# EAGLE design PMT AMP_J000331REVH (EAGLE 7.7.0)

## Sheet 1 of 2
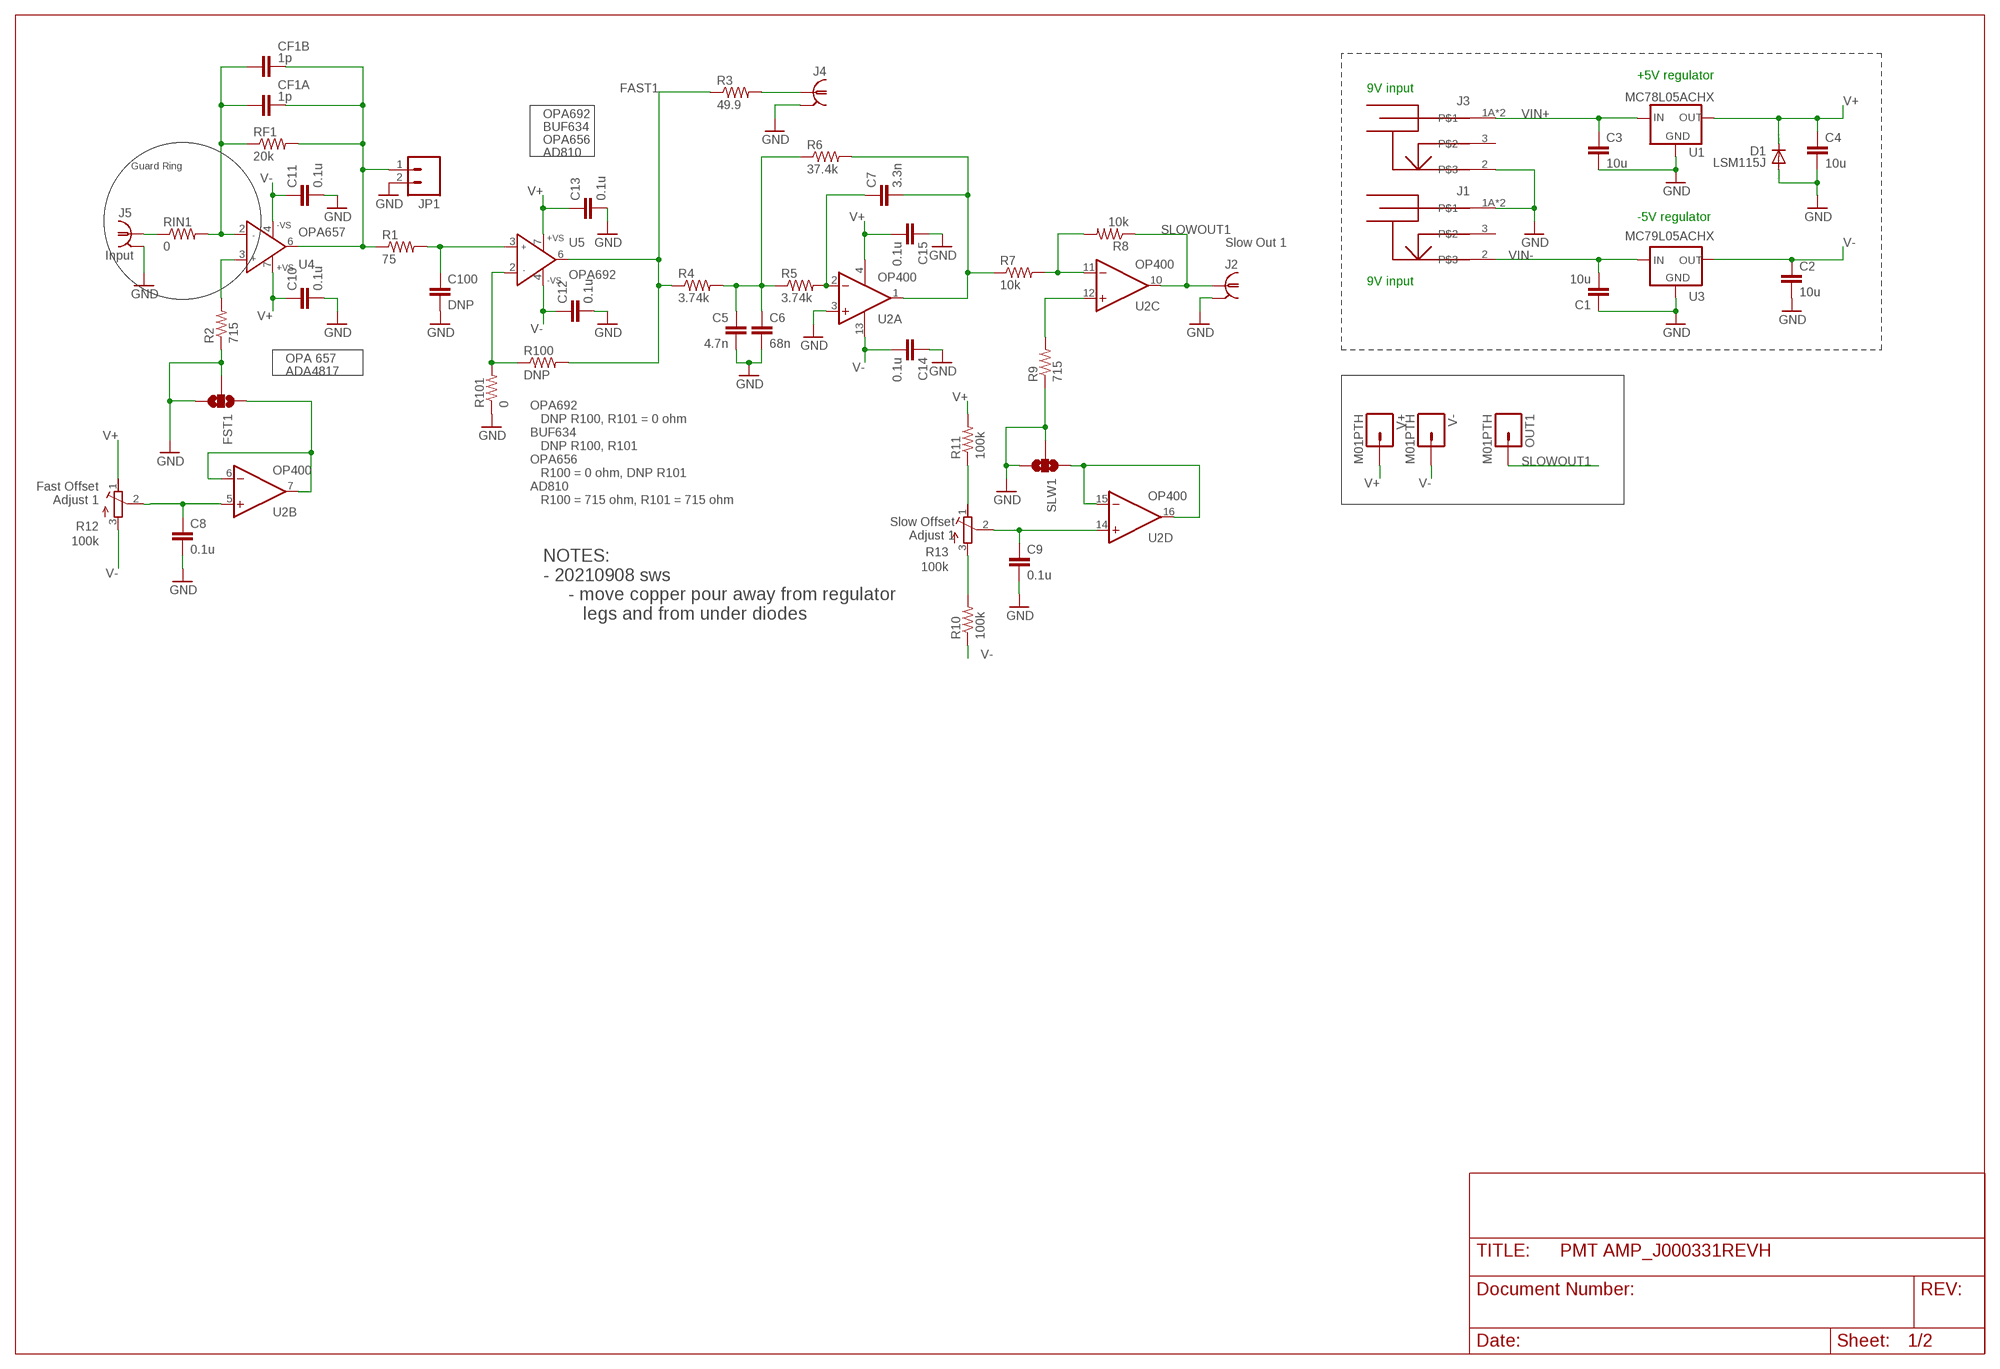
[diagram p0: schematic, sheet 1]

### Parts
C1  10u  C-EUC1206  [C1206]
C2  10u  C-EUC1206  [C1206]
C3  10u  C-EUC1206  [C1206]
C4  10u  C-EUC1206  [C1206]
C5  4.7n  C-EUC0805  [C0805]
C6  68n  C-EUC0805  [C0805]
C7  3.3n  C-EUC0805  [C0805]
C8  0.1u  C-EUC0603  [C0603]
C9  0.1u  C-EUC0603  [C0603]
C10  0.1u  C-EUC0603  [C0603]
C11  0.1u  C-EUC0603  [C0603]
C12  0.1u  C-EUC0603  [C0603]
C13  0.1u  C-EUC0603  [C0603]
C14  0.1u  C-EUC0603  [C0603]
C15  0.1u  C-EUC0603  [C0603]
C100  DNP  C-EUC0805  [C0805]
CF1A  1p  C-EUC1206  [C1206]
CF1B  1p  C-EUC1206  [C1206]
D1  LSM115J  DIODE-DO214BA  [DO214BA]
FST1  SOLDERJUMPER_2WAYS  [SJ_3]
J1  POWER_JACK_SHUNTPJ-002  [PJ-002]
J2  1-227161-0  [AMP_227161]
J3  POWER_JACK_SHUNTPJ-002  [PJ-002]
J4  1-227161-0  [AMP_227161]
J5  1-227161-0  [AMP_227161]
JP1  M02LOCK  [1X02_LOCK]
OUT1  M01PTH  [1X01]
R1  75  R-US_R0805  [R0805]
R2  715  R-US_R0805  [R0805]
R3  49.9  RESISTOR-POWER2512WIDE  [2512LONG]
R4  3.74k  R-US_R0805  [R0805]
R5  3.74k  R-US_R0805  [R0805]
R6  37.4k  R-US_R0805  [R0805]
R7  10k  R-US_R0805  [R0805]
R8  10k  R-US_R0805  [R0805]
R9  715  R-US_R0805  [R0805]
R10  100k  R-US_R0805  [R0805]
R11  100k  R-US_R0805  [R0805]
R12  100k  R-TRIMM3006P  [RTRIM3006P]
R13  100k  R-TRIMM3006P  [RTRIM3006P]
R100  DNP  R-US_R0805  [R0805]
R101  0  R-US_R0805  [R0805]
RF1  20k  R-US_R1206  [R1206]
RIN1  0  R-US_R0805  [R0805]
SLW1  SOLDERJUMPER_2WAYS  [SJ_3]
U1  MC78L05ACHX  78LXXSOT89  [SOT89]
U2  OP400  OP400SO16_W  [SO16L]
U3  MC79L05ACHX  79LXXSOT89  [SOT89]
U4  OPA657  AD820R  [SO8]
U5  OPA692  AD820R  [SO8]
V+  M01PTH  [1X01]
V-  M01PTH  [1X01]

### Nets
FAST1: R3.1 R4.1 R100.2 U5.6(OUT)
FO1: J4.1 R3.2
GND: C1.1 C2.2 C3.2 C4.2 C5.2 C6.2 C8.2 C9.2 C10.2 C11.2 C12.2 C13.2 C14.1 C15.1 C100.2 D1.A FST1.2 FST1.3 J1.1A J1.1B J2.2(GND) J3.2 J4.2(GND) J5.2(GND) JP1.2 R2.1 R9.1 R101.1 SLW1.2 SLW1.3 U1.2(GND) U1.2@1(GND) U2.3(A:+IN) U3.1(GND) ; also sheet 2
N$1: CF1A.1 CF1B.1 RF1.1 RIN1.2 U4.2(IN-)
N$2: R7.2 R8.2 U2.11(C:-IN)
N$3: C100.1 R1.2 U5.3(IN+)
N$4: C8.1 R12.2(S) U2.5(B:+IN)
N$5: C9.1 R13.2(S) U2.14(D:+IN)
N$6: R11.1 R13.1(E)
N$7: R10.2 R13.3(A)
N$8: J5.1 RIN1.1
N$10: R100.1 R101.2 U5.2(IN-)
N$11: C7.1 R5.2 U2.2(A:-IN)
N$12: SLW1.1 U2.15(D:-IN) U2.16(D:OUT)
N$17: FST1.1 U2.6(B:-IN) U2.7(B:OUT)
N$19: C7.2 R6.2 R7.1 U2.1(A:OUT)
N$28: C5.1 C6.1 R4.2 R5.1 R6.1
N$29: R9.2 U2.12(C:+IN)
N$30: R2.2 U4.3(IN+)
SLOWOUT1: J2.1 OUT1.1 R8.1 U2.10(C:OUT)
U4OUT1: CF1A.2 CF1B.2 JP1.1 R1.1 RF1.2 U4.6(OUT)
V+: C4.1 C10.1 C13.1 C15.2 D1.C R11.2 R12.1(E) U1.1(OUT) U2.4(P:V+) U4.7(+VS) U5.7(+VS) V+.1
V-: C2.1 C11.1 C12.1 C14.2 R10.1 R12.3(A) U2.13(P:V-) U3.3(OUT) U4.4(-VS) U5.4(-VS) V-.1
VIN+: C3.1 J3.1A J3.1B U1.3(IN) ; also sheet 2
VIN-: C1.2 J1.2 U3.2(IN) U3.2@1(IN) ; also sheet 2
Unconnected: J1.3 J3.3

### Notes on the sheet
- +5V regulator
- 9V input
- OPA692
- BUF634
- OPA656
- AD810
- Guard Ring
- -5V regulator
- Slow Out 1
- Input
- 9V input
- OPA 657
- ADA4817
- Fast Offset
  Adjust 1
- OPA692
     DNP R100, R101 = 0 ohm
  BUF634
     DNP R100, R101
  OPA656
     R100 = 0 ohm, DNP R101
  AD810
     R100 = 715 ohm, R101 = 715 ohm
- Slow Offset
  Adjust 1
- NOTES:
  - 20210908 sws
       - move copper pour away from regulator
          legs and from under diodes

## Sheet 2 of 2
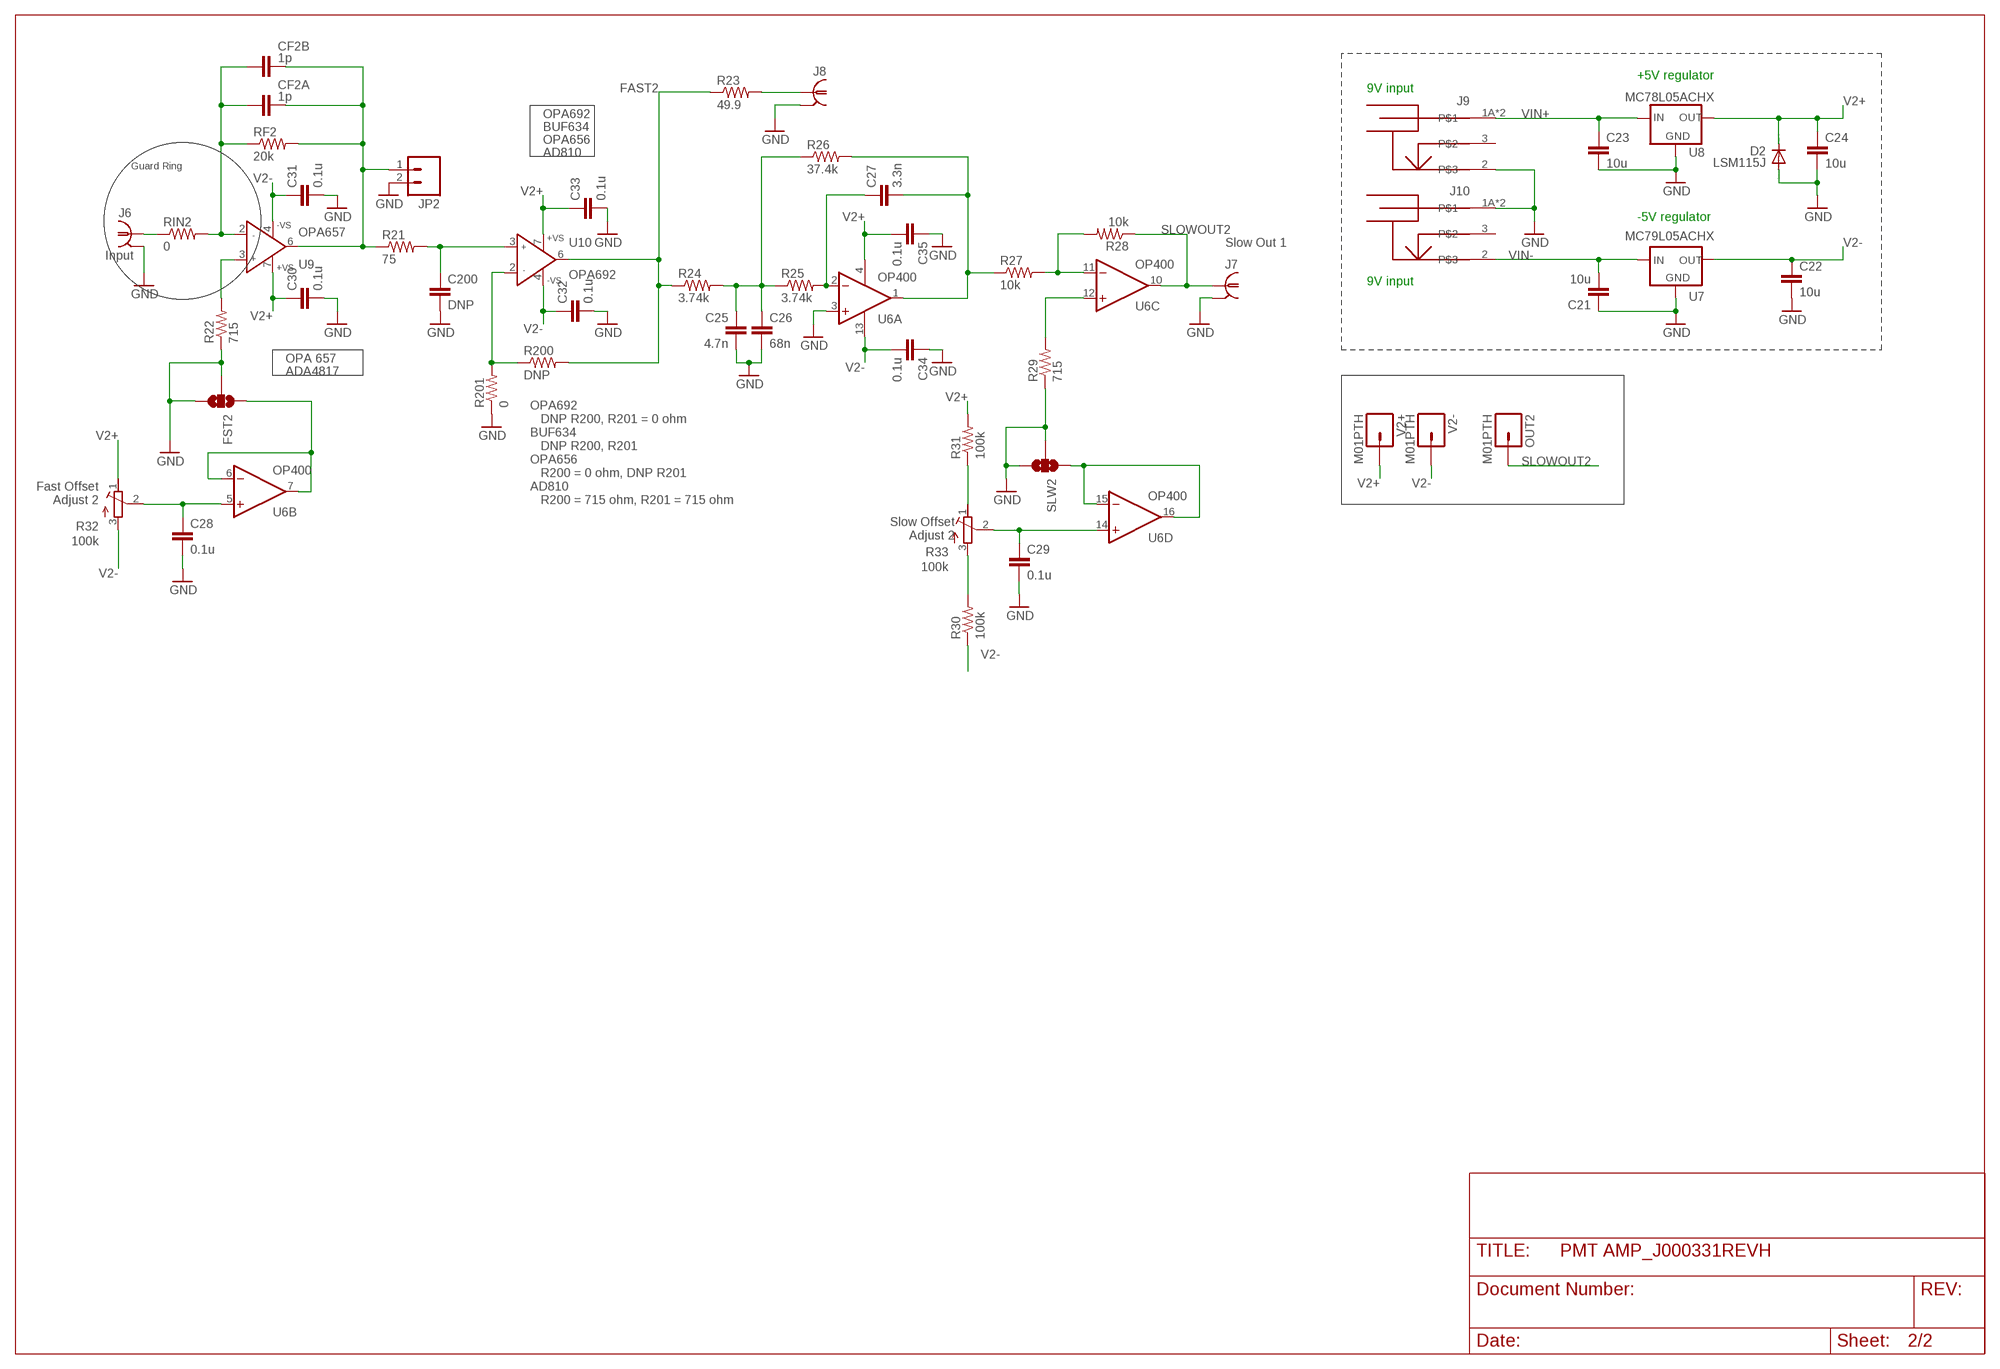
[diagram p1: schematic, sheet 2]

### Parts
C21  10u  C-EUC1206  [C1206]
C22  10u  C-EUC1206  [C1206]
C23  10u  C-EUC1206  [C1206]
C24  10u  C-EUC1206  [C1206]
C25  4.7n  C-EUC0805  [C0805]
C26  68n  C-EUC0805  [C0805]
C27  3.3n  C-EUC0805  [C0805]
C28  0.1u  C-EUC0603  [C0603]
C29  0.1u  C-EUC0603  [C0603]
C30  0.1u  C-EUC0603  [C0603]
C31  0.1u  C-EUC0603  [C0603]
C32  0.1u  C-EUC0603  [C0603]
C33  0.1u  C-EUC0603  [C0603]
C34  0.1u  C-EUC0603  [C0603]
C35  0.1u  C-EUC0603  [C0603]
C200  DNP  C-EUC0805  [C0805]
CF2A  1p  C-EUC1206  [C1206]
CF2B  1p  C-EUC1206  [C1206]
D2  LSM115J  DIODE-DO214BA  [DO214BA]
FST2  SOLDERJUMPER_2WAYS  [SJ_3]
J6  1-227161-0  [AMP_227161]
J7  1-227161-0  [AMP_227161]
J8  1-227161-0  [AMP_227161]
J9  POWER_JACK_SHUNTPJ-002  [PJ-002]
J10  POWER_JACK_SHUNTPJ-002  [PJ-002]
JP2  M02LOCK  [1X02_LOCK]
OUT2  M01PTH  [1X01]
R21  75  R-US_R0805  [R0805]
R22  715  R-US_R0805  [R0805]
R23  49.9  RESISTOR-POWER2512WIDE  [2512LONG]
R24  3.74k  R-US_R0805  [R0805]
R25  3.74k  R-US_R0805  [R0805]
R26  37.4k  R-US_R0805  [R0805]
R27  10k  R-US_R0805  [R0805]
R28  10k  R-US_R0805  [R0805]
R29  715  R-US_R0805  [R0805]
R30  100k  R-US_R0805  [R0805]
R31  100k  R-US_R0805  [R0805]
R32  100k  R-TRIMM3006P  [RTRIM3006P]
R33  100k  R-TRIMM3006P  [RTRIM3006P]
R200  DNP  R-US_R0805  [R0805]
R201  0  R-US_R0805  [R0805]
RF2  20k  R-US_R1206  [R1206]
RIN2  0  R-US_R0805  [R0805]
SLW2  SOLDERJUMPER_2WAYS  [SJ_3]
U6  OP400  OP400SO16_W  [SO16L]
U7  MC79L05ACHX  79LXXSOT89  [SOT89]
U8  MC78L05ACHX  78LXXSOT89  [SOT89]
U9  OPA657  AD820R  [SO8]
U10  OPA692  AD820R  [SO8]
V2+  M01PTH  [1X01]
V2-  M01PTH  [1X01]

### Nets
FAST2: R23.1 R24.1 R200.2 U10.6(OUT)
FO2: J8.1 R23.2
GND: C21.1 C22.2 C23.2 C24.2 C25.2 C26.2 C28.2 C29.2 C30.2 C31.2 C32.2 C33.2 C34.1 C35.1 C200.2 D2.A FST2.2 FST2.3 J6.2(GND) J7.2(GND) J8.2(GND) J9.2 J10.1A J10.1B JP2.2 R22.1 R29.1 R201.1 SLW2.2 SLW2.3 U6.3(A:+IN) U7.1(GND) U8.2(GND) U8.2@1(GND) ; also sheet 1
N$9: CF2A.1 CF2B.1 RF2.1 RIN2.2 U9.2(IN-)
N$13: J6.1 RIN2.1
N$14: C200.1 R21.2 U10.3(IN+)
N$15: R200.1 R201.2 U10.2(IN-)
N$16: C28.1 R32.2(S) U6.5(B:+IN)
N$18: C27.1 R25.2 U6.2(A:-IN)
N$20: C29.1 R33.2(S) U6.14(D:+IN)
N$21: C27.2 R26.2 R27.1 U6.1(A:OUT)
N$22: SLW2.1 U6.15(D:-IN) U6.16(D:OUT)
N$23: R27.2 R28.2 U6.11(C:-IN)
N$24: R31.1 R33.1(E)
N$25: R30.2 R33.3(A)
N$26: C25.1 C26.1 R24.2 R25.1 R26.1
N$27: FST2.1 U6.6(B:-IN) U6.7(B:OUT)
N$33: R29.2 U6.12(C:+IN)
N$34: R22.2 U9.3(IN+)
SLOWOUT2: J7.1 OUT2.1 R28.1 U6.10(C:OUT)
U9OUT1: CF2A.2 CF2B.2 JP2.1 R21.1 RF2.2 U9.6(OUT)
V2+: C24.1 C30.1 C33.1 C35.2 D2.C R31.2 R32.1(E) U6.4(P:V+) U8.1(OUT) U9.7(+VS) U10.7(+VS) V2+.1
V2-: C22.1 C31.1 C32.1 C34.2 R30.1 R32.3(A) U6.13(P:V-) U7.3(OUT) U9.4(-VS) U10.4(-VS) V2-.1
VIN+: C23.1 J9.1A J9.1B U8.3(IN) ; also sheet 1
VIN-: C21.2 J10.2 U7.2(IN) U7.2@1(IN) ; also sheet 1
Unconnected: J9.3 J10.3

### Notes on the sheet
- +5V regulator
- 9V input
- OPA692
- BUF634
- OPA656
- AD810
- Guard Ring
- -5V regulator
- Slow Out 1
- Input
- 9V input
- OPA 657
- ADA4817
- Fast Offset
  Adjust 2
- OPA692
     DNP R200, R201 = 0 ohm
  BUF634
     DNP R200, R201
  OPA656
     R200 = 0 ohm, DNP R201
  AD810
     R200 = 715 ohm, R201 = 715 ohm
- Slow Offset
  Adjust 2

## Library data of the parts
C1-C15 C21-C35 C100 C200 CF1A CF1B CF2A CF2B = rcl:C-EU: CAPACITOR, European symbol
D1 D2 = diode:DIODE-: DIODE
FST1 FST2 SLW1 SLW2 = SparkFun:SOLDERJUMPER_2WAY: Solder Jumper 2 way solder jumper
J1 J3 J9 J10 = STEVES_BU:POWER_JACK_SHUNT
J2 J4-J8 = con-coax:?227161*: JACK, RIGHT ANGLE, 50 OHM, PCB, BNC Source: amp_227161.pdf; MF: TE; MPN: 5413879-1; OC_FARNELL: unknown; OC_NEWARK: 33B3200
JP1 JP2 = SparkFun:M02: Header 2 Standard 2-pin 0.1" header. Use with straight break away headers (SKU : PRT-00116), right angle break away headers (PRT-00553), swiss pins (PRT-00743), machine pins (PRT-00117), and female headers (PRT-00115). Molex polarized connector foot print use with SKU : PRT-08233 with associated crimp pins and housings.
OUT1 OUT2 V2+ V2- V+ V- = SparkFun:M01: Header 1 Standard 1-pin 0.1" header. Use with straight break away headers (SKU : PRT-00116), right angle break away headers (PRT-00553), swiss pins (PRT-00743), machine pins (PRT-00117), and female headers (PRT-00115).
R1 R2 R4-R11 R21 R22 R24-R31 R100 R101 R200 R201 RIN1 RIN2 = rcl:R-US_: RESISTOR, American symbol
R3 R23 = STEVES_BU:RESISTOR-POWER
R12 R13 R32 R33 = rcl:R-TRIMM: Trimm resistor; MF: BOURNS; MPN: 3006P-1-104LF
RF1 RF2 = resistor:R-US_: RESISTOR, American symbol
U1 U8 = jfrc:78LXX: VOLTAGE REGULATOR
U2 U6 = linear:OP400: OP AMP
U3 U7 = jfrc:79LXX: VOLTAGE REGULATOR
U4 U5 U9 U10 = analog-devices:AD820: Single-Supply, Rail-to-Rail, Low Power, FET Input Op Amp Source: http://www.analog.com/static/imported-files/data_sheets/AD820.pdf; OC_FARNELL: 1838867; OC_NEWARK: unknown

## Board
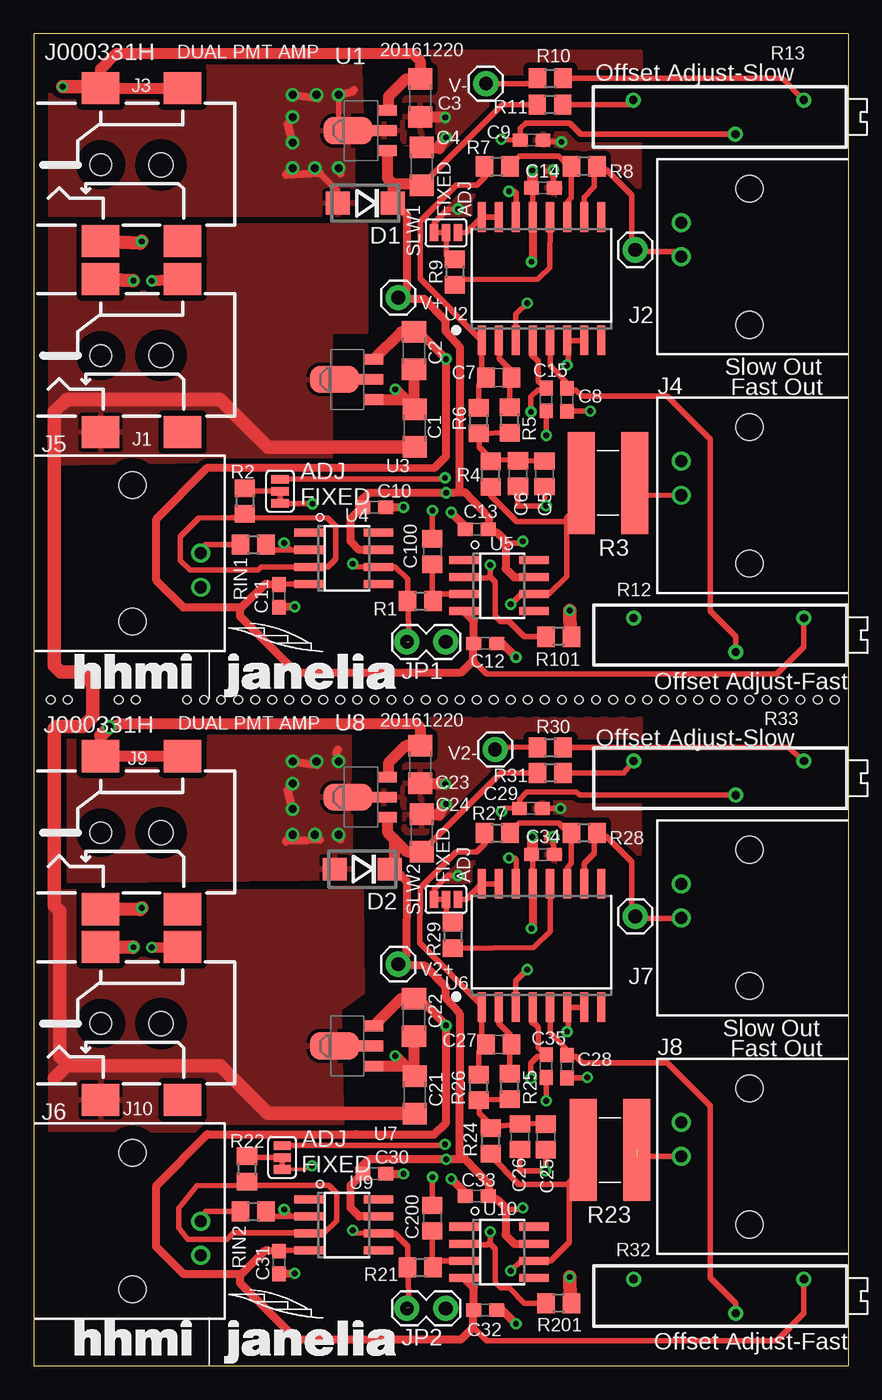
[diagram p2: board, top side]
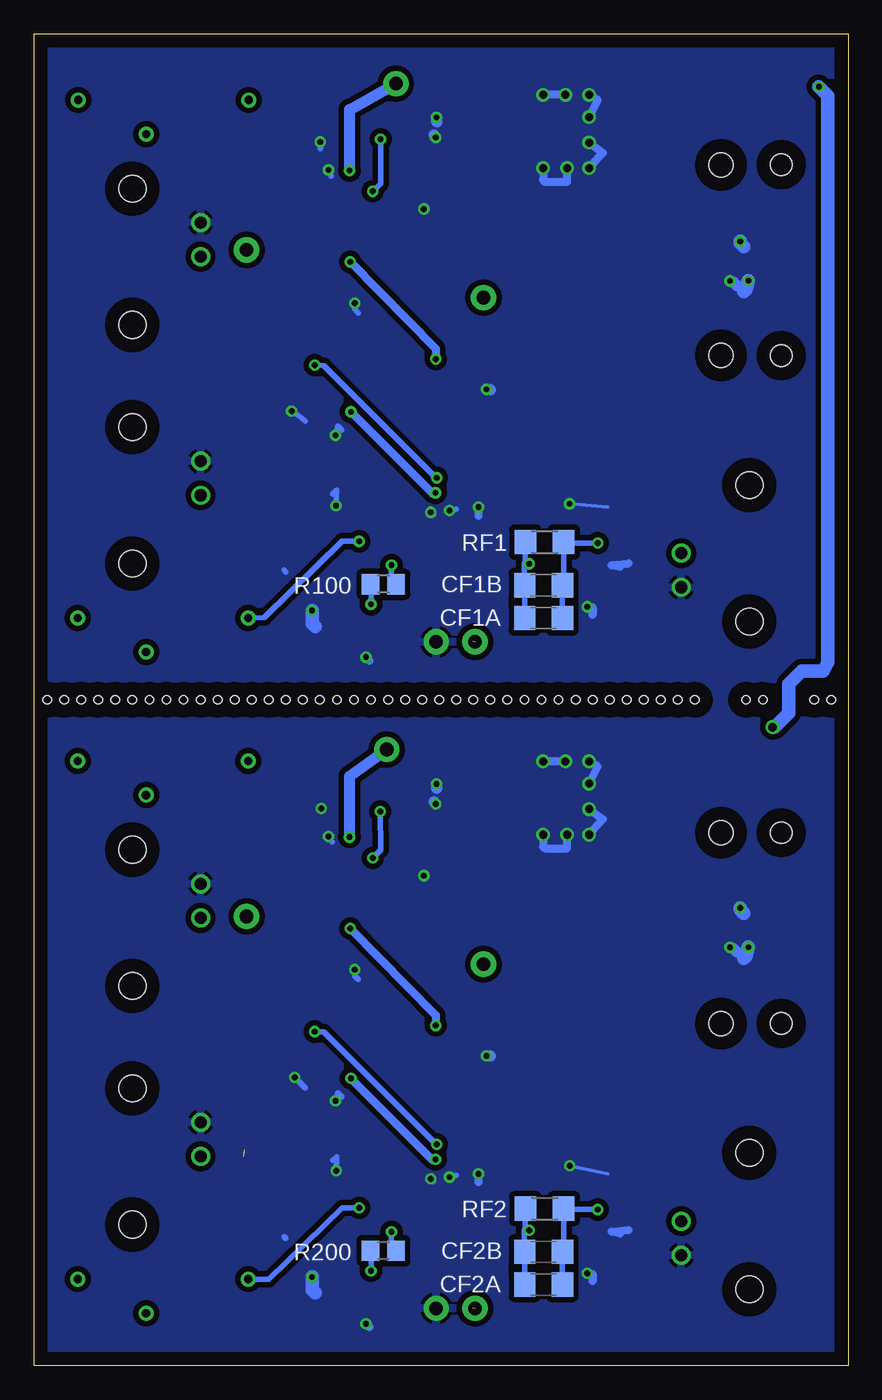
[diagram p3: board, bottom side, seen from below]

Size 60.71 x 99.31 mm. Coordinates in mm from the lower left corner, seen from the top.
Outline: 60.71,99.31 0,99.31 0,0 60.71,0 60.71,99.31
Copper layers (1*16): Top 0.035mm / dielectric 1.5mm / Bottom 0.035mm
Design rules "default *": minimum track width 10mil, minimum drill 17mil, track to track 8mil, track to pad 8mil, pad to pad 8mil, via to via 8mil, smd to smd 8mil, copper to edge 40mil, drill to drill 8mil, minimum pad ring 10mil, minimum via ring 8mil, stop-mask expansion 4mil, vias tented up to drill 25mil, thermal gap 10mil
Holes 0.64 mm at 1.27,49.66 2.54,49.66 6.35,49.66 7.62,49.66 11.43,49.66 12.7,49.66 13.97,49.66 15.24,49.66 16.51,49.66 17.78,49.66 19.05,49.66 20.32,49.66 21.59,49.66 22.86,49.66 24.13,49.66 25.4,49.66 26.67,49.66 27.94,49.66 29.21,49.66 30.48,49.66 31.75,49.66 33.02,49.66 34.29,49.66 35.56,49.66 36.83,49.66 38.1,49.66 39.37,49.66 40.64,49.66 41.91,49.66 43.18,49.66 44.45,49.66 45.72,49.66 46.99,49.66 48.26,49.66 49.53,49.66 50.8,49.66 52.07,49.66 53.34,49.66 54.61,49.66 55.88,49.66 57.15,49.66 58.42,49.66 59.69,49.66

### Footprints (pad centres in the part's own frame; a part is rotated, then mirrored left to right if it is on the bottom)
C1206 = smd 1.6 x 1.8: 1 -1.4,0; 2 1.4,0
C0805 = smd 1.3 x 1.5: 1 -0.95,0; 2 0.95,0
C0603 = smd 1.1 x 1: 1 -0.85,0; 2 0.85,0
DO214BA = smd 1.8 x 1.7: A 2.05,0; C -2.05,0
SJ_3 = smd 0.635 x 1.27: 1 -0.889,0; 2 0,0; 3 0.889,0
PJ-002 = smd 2.8 x 2.4: 1A 5,5.7; 1B 11.1,5.7; 2 5,-5.7; 3 11.1,-5.7 | hole 1.6: 5,0 | hole 1.8: 9.5,0
AMP_227161 = drill 0.9 pad 1.27: 1 0,-5.08; 2 -2.54,-5.08 | hole 2: -5.08,0; 5.08,0
1X02_LOCK = drill 1.016 pad 1.88: 1 -0.178,0; 2 2.718,0
1X01 = drill 1.016 pad 1.88: 1 0,0
R0805 = smd 1.3 x 1.5: 1 -0.95,0; 2 0.95,0
2512LONG = smd 7.6 x 2: 1 0,2; 2 0,-2
RTRIM3006P = drill 0.61: 1 -7.62,1.27; 2 0,-1.27; 3 5.08,1.27
R1206 = smd 1.6 x 1.803: 1 -1.422,0; 2 1.422,0
SOT89 = smd 0.8 x 1.4: 1 -1.499,-1.981; 3 1.499,-1.981 | smd 0.8 x 1.9: 2 0,-1.727 | smd 2.032 x 3.65: 2@1 0,0.94
SO16L = smd 0.6 x 2.2: 1 -4.445,-4.6; 2 -3.175,-4.6; 3 -1.905,-4.6; 4 -0.635,-4.6; 5 0.635,-4.6; 6 1.905,-4.6; 7 3.175,-4.6; 8 4.445,-4.6; 9 4.445,4.6; 10 3.175,4.6; 11 1.905,4.6; 12 0.635,4.6; 13 -0.635,4.6; 14 -1.905,4.6; 15 -3.175,4.6; 16 -4.445,4.6
SO8 = smd 0.6 x 2.2: 1 -1.905,-2.6; 2 -0.635,-2.6; 3 0.635,-2.6; 4 1.905,-2.6; 5 1.905,2.6; 6 0.635,2.6; 7 -0.635,2.6; 8 -1.905,2.6

### Placement (x,y rotation side)
C1  28.4,69.9 270 top
C2  28.35,75.67 270 top
C3  28.8,94.51 270 top
C4  28.93,89.41 90 top
C5  38.07,66.5 270 top
C6  36.09,66.52 270 top
C7  34.67,73.66 180 top
C8  39.75,72.01 270 top
C9  37.11,91.36 0 top
C10  25.4,64.01 0 top
C11  18.29,57.4 270 top
C12  33.66,53.85 0 top
C13  33.02,62.36 180 top
C14  37.95,87.81 180 top
C15  38.2,72.03 90 top
C21  28.4,20.22 270 top
C22  28.35,25.98 270 top
C23  28.8,44.83 270 top
C24  28.93,39.73 90 top
C25  38.18,17.07 270 top
C26  36.25,17.09 270 top
C27  34.67,23.98 180 top
C28  39.75,22.33 270 top
C29  37.06,41.55 0 top
C30  25.4,14.33 0 top
C31  18.29,7.72 270 top
C32  33.66,4.17 0 top
C33  33.02,12.67 180 top
C34  37.95,38.13 180 top
C35  38.2,22.35 90 top
C100  29.72,60.71 90 top
C200  29.72,11.02 90 top
CF1A  22.71,55.75 180 bottom
CF1B  22.71,58.19 180 bottom
CF2A  22.71,6.07 180 bottom
CF2B  22.71,8.51 180 bottom
D1  24.71,86.66 180 top
D2  24.49,37.03 180 top
FST1  18.36,65.2 270 top
FST2  18.52,15.54 270 top
J1  0,75.31 0 top
J2  53.34,82.68 270 top
J3  0,89.53 0 top
J4  53.34,64.9 270 top
J5  7.37,60.58 90 top
J6  7.37,10.79 90 top
J7  53.34,33.4 270 top
J8  53.34,15.62 270 top
J9  0,39.75 0 top
J10  0,25.53 0 top
JP1  27.99,53.97 0 top
JP2  27.99,4.29 0 top
OUT1  44.83,83.19 0 top
OUT2  44.83,33.5 0 top
R1  28.83,57.02 0 top
R2  15.75,64.47 270 top
R3  42.8,65.81 90 top
R4  34.06,66.47 90 top
R5  35.48,70.51 90 top
R6  33.17,70.46 90 top
R7  34.54,89.41 0 top
R8  41.02,89.41 180 top
R9  31.39,81.53 270 top
R10  38.51,95.99 0 top
R11  38.48,94.01 180 top
R12  52.32,54.48 0 top
R13  52.3,93.09 0 top
R21  28.83,7.34 0 top
R22  15.9,14.68 270 top
R23  42.95,16.1 90 top
R24  34.06,16.79 90 top
R25  35.48,20.83 90 top
R26  33.17,20.78 90 top
R27  34.54,39.73 0 top
R28  41.02,39.73 180 top
R29  31.24,32.08 270 top
R30  38.51,46.1 0 top
R31  38.51,44.2 180 top
R32  52.32,5.21 0 top
R33  52.32,43.81 0 top
R100  34.65,58.27 180 bottom
R101  39.12,54.36 180 top
R200  34.65,8.59 180 bottom
R201  39.12,4.67 180 top
RF1  22.63,61.42 180 bottom
RF2  22.63,11.73 180 bottom
RIN1  16.38,61.21 0 top
RIN2  16.38,11.53 0 top
SLW1  30.73,84.45 180 top
SLW2  30.73,34.77 180 top
U1  24.38,92.07 90 top
U2  37.85,81.03 0 top
U3  23.37,73.53 90 top
U4  23.11,60.2 270 top
U5  34.67,58.17 270 top
U6  37.85,31.34 0 top
U7  23.37,23.85 90 top
U8  24.38,42.39 90 top
U9  23.11,10.52 270 top
U10  34.67,8.48 270 top
U$1  JFRC-LOGOLOGO_JANELIA_2014  [LOGO_JANELIA_2014]  2.46,49.81 0 top
U$2  JFRC-LOGOLOGO_JANELIA_2014  [LOGO_JANELIA_2014]  2.46,0.13 0 top
V2+  27.18,29.95 0 top
V2-  34.39,45.95 0 top
V+  27.18,79.63 0 top
V-  33.71,95.58 0 top

### Tracks (layer width: path | path; a pad name or v marks a point on that pad's centre or on a via)
FAST1  (via drill 0.43)
  Top 0.406: v35.56,56.77 36.32,57.53 U5.6 | 37.38,57.53 U5.6 | R3.1 40.8,64.27 39.73,63.19 39.73,63.02 | 39.73,63.02 39.73,58.85 38.41,57.53 U5.6 | R4.1 34.06,64.87 35.99,62.94 39.65,62.94 39.73,63.02
  Bottom 0.406: R100.2 35.5,56.83 v35.56,56.77
FAST2  (via drill 0.43)
  Top 0.406: v35.56,7.09 36.32,7.85 U10.6 | 37.38,7.85 U10.6 | R23.1 40.95,14.79 39.9,13.74 39.9,13.41 | 39.9,13.41 39.9,9.22 38.53,7.85 U10.6 | R24.1 34.06,15.65 36.17,13.54 39.78,13.54 39.9,13.41
  Bottom 0.406: R200.2 35.5,7.15 v35.56,7.09
FO1
  Top 0.406: R3.2 45.19,64.87 J4.1
FO2  (1 unrouted)
  Top 0.406: J8.1 45.03,15.62 45.03,16.81
GND  (via drill 0.43, 0.6)
  Top 0.254: FST2.3 20.24,14.66 v20.75,14.91
  Top 0.406: C9.2 38.28,91.24 v39.34,91.24 | C100.2 v29.72,63.75 | U2.3 35.94,78.38 v36.78,79.22 | C15.1 v38.2,69.37 | C8.2 v41.48,71.17 | C14.1 38.71,88.47 38.66,89.1 38.25,89.05 v38.73,89.15 | C29.2 v39.27,41.55 | C200.2 v29.72,14.07 | v31.62,36.55 30.86,36.55 29.84,35.53 SLW2.3 SLW2.2 30.73,33.48 R29.1 | U6.3 35.94,28.7 v36.78,29.54 | C26.2 36.24,14.55 v38.15,14.55 38.15,15.76 C25.2 | C35.1 v38.2,19.76 | C34.1 38.71,38.79 38.66,39.42 38.25,39.37 v38.73,39.47 | C6.2 36.09,64.11 38.18,64.11 v38.18,64.13 38.08,64.24 C5.2 | v31.62,86.23 30.86,86.23 29.84,85.22 SLW1.3 SLW1.2 30.73,82.8 R9.1 | R2.1 15.82,65.2 FST1.2 FST1.3 18.41,64.26 v20.78,64.26 | R22.1 16.51,15.54 FST2.2 FST2.3 | C28.2 41.21,21.48 v41.25,21.51 | D1.A 22.66,87.57 v20.95,89.28 | v22.73,94.74 22.73,92.79 U1.2@1 U1.2
  Top 0.61: C10.2 v27.56,64.01 | C11.2 18.27,56.6 v19.46,56.59 | C13.2 32.17,62.57 v31.11,63.63 | C12.2 34.92,53.85 v35.94,52.83 | 22.86,88.9 v22.73,89.28 | v20.95,89.28 21.34,88.9 18.8,88.77 v19.3,89.28 | v19.3,91.19 18.92,92.58 v19.3,93.09 | v19.3,94.74 21.21,94.49 v21.08,94.74 | v22.73,94.74 23.75,95 23.88,95.12 | C30.2 v27.56,14.33 | C31.2 18.27,6.92 v19.46,6.91 | C33.2 32.17,12.89 v31.11,13.94 | C32.2 34.92,4.17 v35.94,3.15 | 22.86,39.22 v22.73,39.6 | v20.95,39.6 21.34,39.22 18.8,39.09 v19.3,39.6 | v19.3,41.5 18.92,42.9 v19.3,43.41 | v19.3,45.06 21.21,44.81 v21.08,45.06 | v22.73,45.06 22.55,45.8 22.68,45.92
  Top 0.813: C2.2 28.35,71.35 C1.1 | U3.1 27.66,72.03 C1.1 | C1.1 28.4,71.35 v26.95,72.8 | J1.1B 8.88,80.86 v8.81,80.87 | C3.2 30.64,93.11 v30.68,93.07 | C4.2 30.25,90.75 30.25,90.96 v30.73,91.57 | C22.2 28.35,21.67 C21.1 | U7.1 27.66,22.35 C21.1 | C21.1 28.4,21.67 v26.95,23.11 | J10.1B 8.88,31.18 v8.81,31.19 | C23.2 30.64,43.43 v30.68,43.38 | C24.2 30.25,41.07 30.25,41.27 v30.73,41.88
  Top 1.016: J3.2 7.94,83.71 v8.05,83.82 | J1.1A 7.41,80.88 v7.44,80.9 | R101.1 39.97,55.64 v39.95,56.31 | J9.2 7.94,34.03 v8.05,34.14 | J10.1A 7.41,31.2 v7.44,31.22 | R201.1 39.97,5.96 v39.95,6.63
  Bottom 0.254: v20.78,64.26 17.91,64.01 | v20.75,14.91 17.91,14.33
  Bottom 0.406: v39.34,91.24 39.34,90.73 39.22,91.13 | 42.04,59.31 41.91,59.18 | v29.72,63.75 29.21,63.88 | v36.78,79.22 36.78,78.77 36.5,78.49 | v38.18,64.13 38.12,65.28 38.41,65 | v38.2,69.37 38.05,70.05 37.74,69.75 | v41.48,71.17 40.74,70.69 40.46,70.41 | v38.73,89.15 38.76,89.1 38.53,88.67 | v39.27,41.55 39.24,41.38 39.27,41.4 | 42.04,9.63 41.91,9.5 | v29.72,14.07 29.21,14.2 | v31.62,36.55 31.75,36.42 | v36.78,29.54 36.78,29.08 36.5,28.8 | v38.15,14.55 38.12,15.6 38.41,15.32 | v38.2,19.76 38.05,20.37 37.74,20.07 | v41.25,21.51 40.46,20.73 | v38.73,39.47 38.76,39.42 38.46,39.06 | v31.62,86.23 31.75,86.11
  Bottom 0.61: v27.56,64.01 27.56,63.37 | 17.02,59.56 17.65,59.69 16.38,59.82 | v19.46,56.59 19.05,56.54 19.05,56.01 | v31.11,63.63 30.99,63.5 | v35.94,52.83 35.69,52.58 | v22.73,89.28 22.73,88.39 22.61,88.26 20.95,88.26 v20.95,89.28 | v19.3,89.28 18.29,90.42 v19.3,91.19 | v19.3,93.09 18.67,94.36 v19.3,94.74 | v21.08,94.74 v22.73,94.74 | v27.56,14.33 27.56,13.69 | 17.02,9.88 17.65,10.01 16.38,10.13 | v19.46,6.91 19.05,6.86 19.05,6.32 | v31.11,13.94 30.99,13.82 | v35.94,3.15 35.69,2.9 | v22.73,39.6 22.73,38.71 22.61,38.58 20.95,38.58 v20.95,39.6 | v19.3,39.6 18.29,40.74 v19.3,41.5 | v19.3,43.41 18.67,44.68 v19.3,45.06 | v21.08,45.06 v22.73,45.06
  Bottom 0.813: v26.95,72.8 26.7,72.8 26.67,72.77 | v8.81,80.87 8.56,80.8 8.28,80.52 | v30.68,93.07 30.68,92.76 30.66,92.73 | v30.73,91.57 30.89,91.75 30.76,91.62 | v26.95,23.11 26.7,23.11 26.67,23.09 | v8.81,31.19 8.56,31.11 8.28,30.84 | v30.68,43.38 30.68,43.08 30.66,43.05 | v30.73,41.88 30.89,42.06 30.76,41.93
  Bottom 1.016: v8.05,83.82 8.05,83.69 7.77,83.41 | v7.44,80.9 7.64,80.19 7.77,80.06 | v39.95,56.31 39.95,55.35 39.73,55.12 | v8.05,34.14 8.05,34.01 7.77,33.73 | v7.44,31.22 7.64,30.5 7.77,30.38 | v39.95,6.63 39.95,5.66 39.73,5.44
  pour Bottom (isolate 0.406): -2.79,100.46 62.48,100.46 63.88,-4.06 -1.4,-4.06
  pour Top (isolate 0.406): 1.14,97.92 24.28,97.92 24.41,93.07 26.62,93.07 26.49,97.92 45.21,97.92 45.09,85.85 29.69,85.85 29.69,91.11 23.77,91.11 23.77,85.8 1.02,85.85
  pour Top (isolate 0.406): 1.14,48.23 23.52,48.46 23.52,43.48 26.14,43.48 26.14,48.23 45.21,48.23 45.09,36.17 26.97,36.17 27.08,41.25 23.65,41.25 23.55,36.37 1.02,36.17
N$1  (via drill 0.43)
  Top 0.406: RIN1.2 18,60.83 U4.2 19.18,60.83 v18.67,61.34
  Bottom 0.406: CF1A.1 CF1B.1 21.21,58.29 RF1.1 21.13,61.34 v18.67,61.34
N$2
  Top 0.406: R7.2 36.2,90.17 39.12,90.17 39.88,89.41 R8.2 40.08,89.4 40.08,87.07 39.75,86.74 U2.11
N$3
  Top 0.406: U5.3 29.97,57.53 R1.2 29.72,57.06 C100.1
N$4
  Top 0.406: U2.5 38.48,74.55 39.62,73.41 39.62,72.9 C8.1 39.78,72.75 40.41,72.75 40.87,72.29 47.22,72.29 50.42,69.09 50.42,56.26 52.32,54.36 R12.2
N$5  (via drill 0.43)
  Top 0.406: v34.85,91.44 34.82,91.39 C9.1 36.26,92.24 36.68,92.63 39.95,92.63 40.77,91.82 R13.2 | v35.43,87.55 35.81,87.55 35.97,87.4 35.97,85.65 U2.14
  Bottom 0.406: v34.85,91.44 34.85,88.14 v35.43,87.55
N$6
  Top 0.406: R13.1 44.37,94 R11.1
N$7
  Top 0.406: R10.2 55.8,95.99 R13.3
N$8
  Top 0.406: RIN1.1 12.83,61.21 J5.1
N$9  (via drill 0.43)
  Top 0.406: RIN2.2 18,11.15 U9.2 19.18,11.15 v18.67,11.66
  Bottom 0.406: CF2A.1 CF2B.1 21.21,8.61 RF2.1 21.13,11.66 v18.67,11.66
N$10  (via drill 0.43)
  Top 0.406: 34.04,58.93 33.82,58.71 32.07,58.71 U5.2 | 34.04,58.93 v34.04,59.69 | R101.2 36.58,54.36 35.43,55.5 34.8,55.5 34.42,55.88 34.42,58.42 34.04,58.8 34.04,58.93
  Bottom 0.406: v34.04,59.69 34.04,58.51 R100.1
N$11
  Top 0.406: U2.2 34.7,76.4 34.7,75.08 36.07,73.71 C7.1 35.48,73.52 R5.2
N$12
  Top 0.406: SLW1.1 32.23,84.45 U2.16 U2.15
N$13
  Top 0.406: RIN2.1 12.83,11.53 J6.1
N$14
  Top 0.406: U10.3 29.97,7.85 R21.2 29.72,7.38 C200.1
N$15  (via drill 0.43)
  Top 0.406: 34.04,9.25 33.82,9.03 32.07,9.03 U10.2 | 34.04,9.25 v34.04,10.01 | R201.2 36.58,4.67 35.43,5.82 34.8,5.82 34.42,6.2 34.42,8.74 34.04,9.12 34.04,9.25
  Bottom 0.406: v34.04,10.01 34.04,8.83 R200.1
N$16
  Top 0.406: U6.5 38.48,24.87 39.62,23.72 39.62,23.22 C28.1 39.78,23.06 40.41,23.06 40.87,22.61 47.22,22.61 50.42,19.41 50.42,6.58 52.32,4.67 R32.2
N$17  (via drill 0.43)
  Top 0.406: U2.6 39.85,76.43 | 39.85,76.43 U2.7 40.95,76.35 | FST1.1 30.38,66.12 v30.66,66.19 | 39.85,76.43 39.85,74.91 v39.75,74.6
  Bottom 0.406: v30.66,66.19 30.68,66.19 39.06,74.57 v39.75,74.6
N$18
  Top 0.406: U6.2 34.67,25.53 35.51,24.69 35.51,24.09 C27.1 35.48,23.84 R25.2
N$19
  Top 0.406: 33.4,89.41 R7.1 33.66,88.65 33.02,88.01 31.5,88.01 28.8,85.32 28.8,83.39 28.83,81.03 U2.1 33.4,73.98 C7.2 33.17,73.11 R6.2
N$20  (via drill 0.43)
  Top 0.406: v34.87,41.33 35.13,41.58 C29.1 36.21,42.23 36.75,42.77 40.44,42.77 40.69,42.54 R33.2 | v35.43,37.87 35.81,37.87 35.97,37.72 35.97,35.97 U6.14
  Bottom 0.406: v34.87,41.33 34.85,38.46 v35.43,37.87
N$21
  Top 0.406: 33.4,39.73 R27.1 33.66,38.96 33.02,38.33 31.5,38.33 28.8,35.64 28.78,31.52 33.38,26.92 U6.1 33.4,24.3 C27.2 33.17,23.43 R26.2
N$22
  Top 0.406: SLW2.1 32.23,34.77 U6.16 U6.15
N$23
  Top 0.406: R27.2 36.2,40.49 39.12,40.49 39.88,39.73 R28.2 40.08,39.71 40.08,37.44 39.75,37.11 U6.11
N$24
  Top 0.406: R31.1 43.97,44.2 R33.1
N$25
  Top 0.406: R30.2 56.24,46.1 R33.3
N$26
  Top 0.406: R24.2 34.06,17.96 | 34.06,17.96 33.2,18.82 R26.1 35.43,19.89 R25.1 | 34.06,17.96 34.54,17.86 C26.1 38.15,18.09 C25.1
N$27  (via drill 0.43)
  Top 0.406: U6.6 39.85,26.74 | 39.85,26.74 U6.7 40.95,26.67 | FST2.1 30.38,16.43 v30.66,16.51 | 39.85,26.74 39.85,25.22 v39.75,24.92
  Bottom 0.406: v30.66,16.51 30.68,16.51 39.06,24.89 v39.75,24.92
N$28
  Top 0.406: R4.2 34.06,67.64 | 34.06,67.64 33.2,68.5 R6.1 35.43,69.57 R5.1 | 34.06,67.64 34.54,67.54 C6.1 36.09,67.5 C5.1
N$29
  Top 0.406: R9.2 31.85,80.97 37.57,81 38.46,81.86 U2.12
N$30
  Top 0.406: U4.3 21.92,59.56 22.5,60.15 22.5,62.61 21.92,63.19 15.44,63.22 | 15.44,63.22 15.11,63.22 | 15.11,63.22 12.29,63.19 10.92,61.82 10.92,60.05 11.68,59.31 16.71,59.33 16.97,59.56 20.22,59.56 | 14.73,63.22 15.11,63.22 | R2.2 15.44,63.4 15.44,63.22
N$33
  Top 0.406: R29.2 37.29,31.19 38.48,32.38 U6.12
N$34
  Top 0.406: R22.2 16.26,13.82 15.95,13.49 15.98,13.46 | 15.98,13.46 22,13.46 22.58,12.88 22.58,10.82 21.67,9.91 | 21.67,9.91 14.88,9.91 14.43,9.45 11.48,9.45 10.82,10.31 10.82,11.76 12.17,13.44 15.98,13.46 | 21.67,9.91 21.64,9.88 U9.3
SLOWOUT1
  Top 0.406: U2.10 41.02,87.12 41.78,87.88 41.78,89.15 | 41.78,89.15 41.78,89.28 R8.1 | 41.78,89.15 42.67,89.15 44.58,87.25 44.58,83.44 OUT1.1 44.83,83.06 48.13,83.06 J2.1
SLOWOUT2
  Top 0.406: U6.10 41.02,37.44 41.78,38.2 41.78,39.47 | 41.78,39.47 41.78,39.6 R28.1 | 41.78,39.47 42.67,39.47 44.58,37.57 44.58,33.76 OUT2.1 44.83,33.38 48.13,33.38 J7.1
U4OUT1  (via drill 0.43)  (1 unrouted)
  Top 0.406: 27.98,54.01 R1.1 27.86,57.04 27.86,58.65 26.95,59.56 U4.6 | U4.6 25.53,59.56 | U4.6 24.08,59.59 v23.77,59.79
  Bottom 0.406: RF1.2 24.05,59.89 | 24.05,59.89 24.13,59.82 24.13,58.21 CF1B.2 CF1A.2 | v23.77,59.79 23.98,59.82 24.05,59.89
U9OUT1  (via drill 0.43)  (1 unrouted)
  Top 0.406: 27.98,4.33 R21.1 27.89,7.35 27.89,8.91 26.92,9.88 U9.6 | U9.6 25.53,9.88 | U9.6 24.08,9.91 v23.77,10.11
  Bottom 0.406: RF2.2 24.05,10.21 | 24.05,10.21 24.13,10.13 24.13,8.53 CF2B.2 CF2A.2 | v23.77,10.11 23.98,10.13 24.05,10.21
V2+  (via drill 0.43)
  Top 0.406: 35.18,11.66 36.2,11.66 v36.45,11.79 | v37.06,21.44 37.06,22.55 37.57,23.06 38.15,23.06 C35.2 37.62,23.7 37.62,25.22 37.21,25.63 | D2.C 26.9,37.03 | 26.9,39.24 26.85,39.29 | R31.2 34.8,44.2 C24.1
  Top 0.61: 30.56,15.39 24.97,15.39 24.26,14.71 24.26,14.45 | 24.26,14.45 24.26,14.11 23.62,13.48 23.62,11.79 24.26,11.15 U9.7 | 30.56,15.39 v30.76,15.39 31.73,15.42 31.75,26.26 30.73,27.41 30.73,28.25 29.13,29.84 27.28,29.84 V2+.1 27.79,30.63 27.81,36.12 26.9,37.03 | U6.4 37.21,25.63 | C30.1 24.38,14.33 24.26,14.45 | 30.56,15.39 32.13,15.44 33.91,13.56 33.91,12.46 C33.1 34.54,12.42 35.18,11.79 35.18,11.66 35.18,9.75 35.81,9.12 U10.7
  Top 0.813: 28.9,38.35 C24.1 27.82,38.33 26.85,39.29 26.36,39.78 U8.1 | 26.9,37.03 26.9,39.24
  Bottom 0.406: v36.45,11.79 37.72,11.79 43.18,6.48 R32.1
  Bottom 0.61: v30.76,15.39 30.79,15.39 30.96,15.34 v37.06,21.44
V2-  (via drill 0.43)
  Top 0.406: 32.77,2.9 33.78,1.88 55.37,1.88 57.4,3.91 57.38,3.94 R32.3 | U9.4 18,8.61 C31.1 | U6.13 37.19,38.23 C34.2 | R30.1 34.47,46.13 V2-.1
  Top 0.61: C31.1 17.49,8.61 17.27,8.61 15.49,6.83 15.37,6.83 | 15.37,6.83 11.18,6.83 9.14,8.86 9.14,13.44 12.95,17.27 24.03,17.27 24.38,17.25 29.84,17.25 30.73,18.14 v30.73,25.37 28.72,27.38 | U10.4 32.8,5.84 C32.1 32.77,4.13 32.77,2.9 31.88,2.01 19.56,2.01 15.37,6.2 15.37,6.83 | U6.13 37.21,32.74 v37.11,32.61
  Top 0.813: C22.1 27.38,27.38 U7.3 | 37.19,38.23 37.19,39.39 v37.16,39.42
  Top 1.016: 28.72,27.38 C22.1
  Bottom 0.61: v37.11,32.61 30.73,26.14 v30.73,25.37
  Bottom 0.813: v37.16,39.42 37.16,43.97 V2-.1
V+  (via drill 0.43)
  Top 0.406: 35.18,61.34 36.2,61.34 v36.45,61.47 | v37.06,71.12 37.06,72.24 37.57,72.75 38.15,72.75 C15.2 37.62,73.38 37.62,74.91 37.21,75.31 | 28.83,88.11 C4.1 34.93,94 R11.2 | 26.77,86.67 D1.C 26.92,86.66
  Top 0.61: 30.56,65.07 24.97,65.07 24.26,64.39 24.26,64.13 | 24.26,64.13 24.26,63.79 23.62,63.16 23.62,61.47 24.26,60.83 U4.7 | 30.56,65.07 v30.76,65.07 31.73,65.1 31.75,75.95 30.73,77.09 30.73,77.93 29.13,79.53 27.28,79.53 V+.1 27.81,80.26 27.81,85.78 26.92,86.66 | U2.4 37.21,75.31 | C10.1 24.38,64.01 24.26,64.13 | 30.56,65.07 32.13,65.13 33.91,63.25 33.91,62.14 C13.1 34.54,62.1 35.18,61.47 35.18,61.34 35.18,59.44 35.81,58.8 U5.7
  Top 0.813: 28.9,88.04 C4.1 | U1.1 26.36,88.52 26.77,88.11 | 26.77,88.11 28.83,88.11 | 26.77,88.11 26.77,86.67
  Bottom 0.406: v36.45,61.47 37.72,61.47 43.51,55.78 R12.1
  Bottom 0.61: v30.76,65.07 30.79,65.07 30.96,65.02 v37.06,71.12
V-  (via drill 0.43)
  Top 0.406: 32.77,52.58 33.78,51.56 55.37,51.56 57.4,53.59 R12.3 | U4.4 18,58.29 C11.1 | U2.13 37.19,87.91 C14.2 | R10.1 37.06,95.58 V-.1
  Top 0.61: C11.1 17.49,58.29 17.27,58.29 15.49,56.51 15.37,56.51 | 15.37,56.51 11.18,56.51 9.14,58.55 9.14,63.12 12.95,66.95 26.11,66.95 29.84,66.93 30.73,67.82 v30.73,75.06 28.72,77.07 C2.1 | U5.4 32.8,55.53 C12.1 32.77,53.81 32.77,52.58 31.88,51.69 19.56,51.69 15.37,55.88 15.37,56.51 | U2.13 37.21,82.42 v37.11,82.3
  Top 0.813: C2.1 27.38,77.07 U3.3 | 37.19,87.91 37.19,89.08 v37.16,89.1
  Bottom 0.61: v37.11,82.3 30.73,75.82 v30.73,75.06
  Bottom 0.813: v37.16,89.1 37.16,93.65 V-.1
VIN+  (via drill 0.43, 0.64)
  Top 0.813: J3.1B J3.1A 5,96.67 6.17,97.84 28.25,97.84 28.8,97.28 C3.1 27.74,95.91 26.44,94.61 26.44,93.65 U1.3 | J9.1B J9.1A 5,46.94 5,46.99 v5.64,47.62 6.43,47.88 28.5,47.88 28.8,47.6 C23.1 27.74,46.23 26.44,44.93 26.44,43.97 U8.3
  Top 1.016: v2.18,95.35 4.76,95.35 J3.1A | 4.76,45.67 J9.1A | v5.64,47.62 5.64,47.58 5,46.94
  Bottom 1.016: v2.18,95.35 1.52,94.69 1.52,52.45 1.88,51.79 3.45,51.79 4.42,50.82 4.42,48.67 5.46,47.62 v5.64,47.62
VIN-
  Top 0.406: U3.2 U3.2@1 | U7.2 U7.2@1
  Top 1.016: C1.2 17.45,68.5 13.92,72.03 2.46,72.03 1.55,71.12 1.55,52.22 2.03,51.74 3.5,51.74 4.42,50.82 4.42,48.39 3.66,47.65 1.75,47.68 1.55,47.5 1.55,34.31 1.96,33.91 1.96,23.09 2.69,22.35 | C21.2 17.45,18.82 13.92,22.35 2.69,22.35 | 2.69,22.35 2.46,22.35 1.55,21.44
  pour Top (isolate 0.406): 0.89,85.01 24.77,84.94 24.77,77.14 22.1,77.14 22.1,67.64 22.58,67.64 1.14,67.31
  pour Top (isolate 0.406): 0.89,35.33 24.41,35.33 24.49,27.84 22.78,26.62 22.96,17.48 1.14,17.63

### Text on the board
tPlace: J000331H | DUAL PMT AMP | 20161220 | Offset Adjust-Slow | FIXED / ADJ | Slow Out | Fast Out | ADJ / FIXED | Offset Adjust-Fast | J000331H | DUAL PMT AMP | 20161220 | Offset Adjust-Slow | FIXED / ADJ | Slow Out | Fast Out | ADJ / FIXED | Offset Adjust-Fast
Reference: 1. Adjust board size to be smaller | 2. Changed OP400 - U3's footprint to match the 16SOIC | 3. Reroute traces to not be underneath (top layer) most of the chips | 4. Changed Ground plane isolate to be 0.016 | 5. Replaced regulators | 6. Adjust board size for enclosure | 7. Mirrored Pot pins to be an accurate footprint | 8. Made fast path more of a short direct line to avoid any noise issues | 9. Switched regulators to be smd components | 10. Delete tant cap marking for regular ceramic caps | 11. Changed font to be uniform and vector style | 2.2" | 1. Adjust board size to be smaller | 2. Changed OP400 - U3's footprint to match the 16SOIC | 3. Reroute traces to not be underneath (top layer) most of the chips | 4. Changed Ground plane isolate to be 0.016 | 5. Replaced regulators | 6. Adjust board size for enclosure | 7. Mirrored Pot pins to be an accurate footprint | 8. Made fast path more of a short direct line to avoid any noise issues | 9. Switched regulators to be smd components | 10. Delete tant cap marking for regular ceramic caps | 11. Changed font to be uniform and vector style
enclosure: NORMAL | 1/2 GAIN | 1/3 GAIN | 1/4 GAIN | NORMAL | 1/2 GAIN | 1/3 GAIN | 1/4 GAIN